# EAGLE design Main (EAGLE 7.1.0)
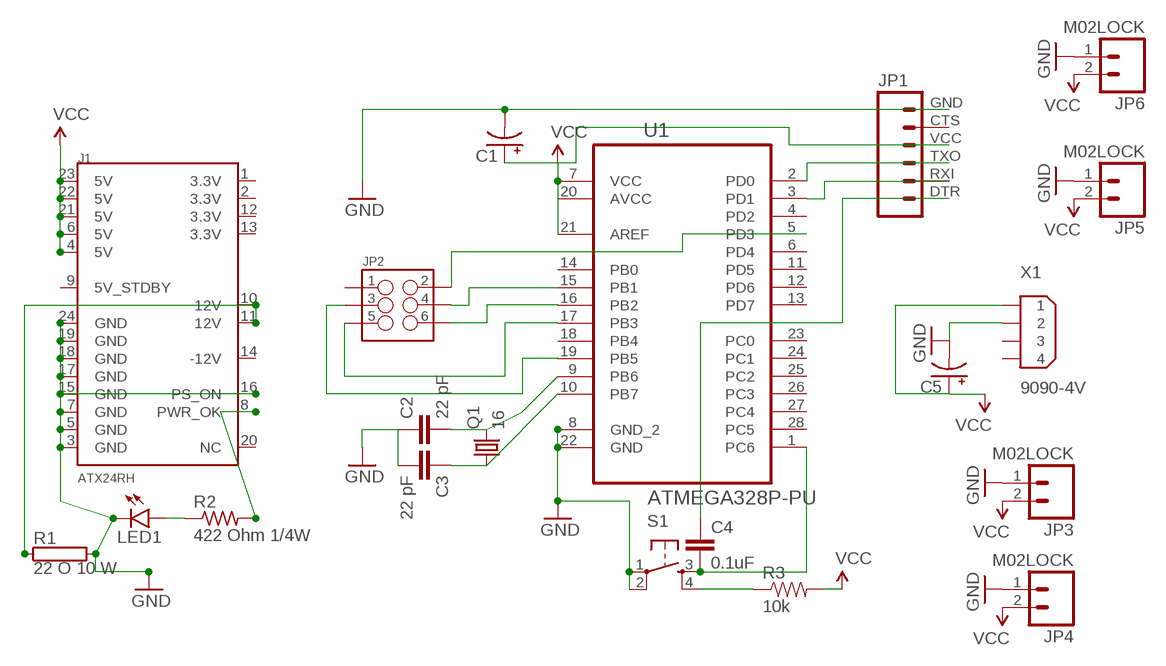
[diagram p0: schematic, sheet 1]

## Parts
C1  CAP_POLPTH2  [CPOL-RADIAL-10UF-25V]
C2  22 pF  C2,5-3  [C2.5-3]
C3  22 pF  C2,5-3  [C2.5-3]
C4  0.1uF  0.1UF-25V-5%(0603)  [0603-CAP]
C5  CAP_POLPTH2  [CPOL-RADIAL-10UF-25V]
J1  ATX24RH  [ATX24_RIGHT_ANGLE]
JP1  M06SIP  [1X06]
JP2  M03X22X3_SILK_SM  [2X3]
JP3  M02LOCK  [1X02_LOCK]
JP4  M02LOCK  [1X02_LOCK]
JP5  M02LOCK  [1X02_LOCK]
JP6  M02LOCK  [1X02_LOCK]
LED1  LED0603  [LED-0603]
Q1  16  CRYSTALHC49S  [HC49/S]
R1  22 O 10 W  RRWM8X45  [RWM8X45]
R2  422 Ohm 1/4W  R-US_M3216  [M3216]
R3  10k  10KOHM-1/4W5%(PTH)  [AXIAL-0.3]
S1  TAC_SWITCHPTH  [TACTILE-PTH]
U1  ATMEGA328P-PU  [DIP254P762X457-28]
X1  9090-4V  [9090-4V]

## Nets
GND: C1.2(-) C2.1 C3.2 C5.2(-) J1.3(GND) J1.5(GND) J1.7(GND) J1.15(GND) J1.16(PS_ON) J1.17(GND) J1.18(GND) J1.19(GND) J1.24(GND) JP1.GND JP3.1 JP4.1 JP5.1 JP6.1 LED1.C R1.2 S1.1 S1.2 U1.8(GND_2) U1.22(GND) X1.2
N$1: C4.2 S1.3 U1.1(PC6)
N$2: J1.10(12V) J1.11(12V) R1.1
N$3: LED1.A R2.1
N$4: J1.8(PWR_OK) R2.2
N$5: R3.P$1 S1.4
N$7: C2.2 Q1.2 U1.9(PB6)
N$8: C3.1 Q1.1 U1.10(PB7)
N$10: JP1.TXO U1.2(PD0)
N$11: JP1.RXI U1.3(PD1)
N$12: C4.1 JP1.DTR
N$13: JP2.3 U1.19(PB5)
N$14: JP2.5 U1.17(PB3)
N$16: JP2.6 U1.16(PB2)
N$17: JP2.4 U1.15(PB1)
N$18: JP2.2 U1.5(PD3)
VCC: C1.1(+) C5.1(+) J1.4(5V) J1.6(5V) J1.21(5V) J1.22(5V) J1.23(5V) JP1.VCC JP3.2 JP4.2 JP5.2 JP6.2 R3.P$2 U1.7(VCC) U1.20(AVCC) U1.21(AREF) X1.1
Unconnected: J1.1(3.3V) J1.2(3.3V) J1.9(5V_STDBY) J1.12(3.3V) J1.13(3.3V) J1.14(-12V) J1.20(NC) JP1.CTS JP2.1 U1.4(PD2) U1.6(PD4) U1.11(PD5) U1.12(PD6) U1.13(PD7) U1.14(PB0) U1.18(PB4) U1.23(PC0) U1.24(PC1) U1.25(PC2) U1.26(PC3) U1.27(PC4) U1.28(PC5) X1.3 X1.4

## Library data of the parts
C1 C5 = SparkFun-Capacitors:CAP_POL: Capacitor Polarized These are standard SMD and PTH capacitors. Normally 10uF, 47uF, and 100uF in electrolytic and tantalum varieties. Always verify the external diameter of the through hole cap, it varies with capacity, voltage, and manufacturer. The EIA devices should be standard.
C2 C3 = capacitor-wima:C: CAPACITOR naming: grid - package width
C4 = SparkFun-Capacitors:0.1UF-25V-5%(0603): CAP-08604; PROD_ID: CAP-08604
J1 = SparkFun-Connectors:ATX24: ATX24 Pin Power Supply Connector This is a good connector for connecting a computer power supply to a PCB. It's massive, but provides many amps of power at 5V and 12V. SKU: PRT-09498
JP1 = SparkFun-Connectors:M06: Header 6 Standard 6-pin 0.1" header. Use with straight break away headers (SKU : PRT-00116), right angle break away headers (PRT-00553), swiss pins (PRT-00743), machine pins (PRT-00117), and female headers (PRT-00115). Molex polarized connector foot print use with SKU : PRT-08094 with associated crimp pins and housings. NOTES ON THE VARIANTS LOCK and LOCK_LONGPADS... This footprint was designed to help hold the alignment of a through-hole component (i.e. 6-pin header) while soldering it into place. You may notice that each hole has been shifted either up or down by 0.005 of an inch from it's more standard position (which is a perfectly straight line). This slight alteration caused the pins (the squares in the middle) to touch the edges of the holes. Because they are alternating, it causes a "brace" to hold the component in place. 0.005 has proven to be the perfect amount of "off-center" position when using our standard breakaway headers. Although looks a little odd when you look at the bare footprint, once you have a header in there, the alteration is very hard to notice. Also,if you push a header all the way into place, it is covered up entirely on the bottom side. This idea of altering the position of holes to aid alignment will be further integrated into the Sparkfun Library for other footprints. It can help hold any component with 3 or more connection pins.
JP2 = SparkFun-Connectors:M03X2: 2x3 .1" header. Shrouded, with keying- CONN-10681 SMT- CONN-11415 Pogo pins- HW-11044
JP3-JP6 = SparkFun-Connectors:M02: Standard 2-pin 0.1" header. Use with - straight break away headers ( PRT-00116) - right angle break away headers (PRT-00553) - swiss pins (PRT-00743) - machine pins (PRT-00117) - female headers (PRT-00115) Molex polarized connector foot print use with: PRT-08233 with associated crimp pins and housings. 2.54_SCREWTERM for use with PRT-10571. 3.5mm Screw Terminal footprints for PRT-08084 5mm Screw Terminal footprints for use with PRT-08432
LED1 = SparkFun-LED:LED: LEDs Standard schematic elements and footprints for 5mm, 3mm, 1206, and 0603 sized LEDs. 5mm - Spark Fun Electronics SKU : COM-00529 (and others)
Q1 = crystal:CRYSTAL: CRYSTAL; OC_FARNELL: 1667008; OC_NEWARK: unknown
R1 = resistor-power:R: Power Resitor; OC_FARNELL: unknown; OC_NEWARK: unknown
R2 = resistor:R-US_: RESISTOR, American symbol
R3 = SparkFun-Resistors:10KOHM-1/4W5%(PTH): RES-09435; PROD_ID: RES-9435
S1 = SparkFun-Electromechanical:TAC_SWITCH: Momentary Switch Button commonly used for reset or general input. Spark Fun Electronics SKU : COM-00097 SMT- SWCH-08247
U1 = Atmel_By_element14_Batch_1-00:ATMEGA328P-PU: 8-bit Microcontroller with In-System Programmable Flash; MPN: ATMEGA328P-PU; OC_FARNELL: 1715487; OC_NEWARK: 15R0268; PACKAGE: PDIP-28; SUPPLIER: Atmel
X1 = con-thomas-betts:9090-4: Disk Drive Power four position Source: Thomas & Betts Electronic Interconnects Eiropean Edition 1998; OC_FARNELL: unknown; OC_NEWARK: unknown

## Net classes
0 default: clearance 0.205 mm

## Board
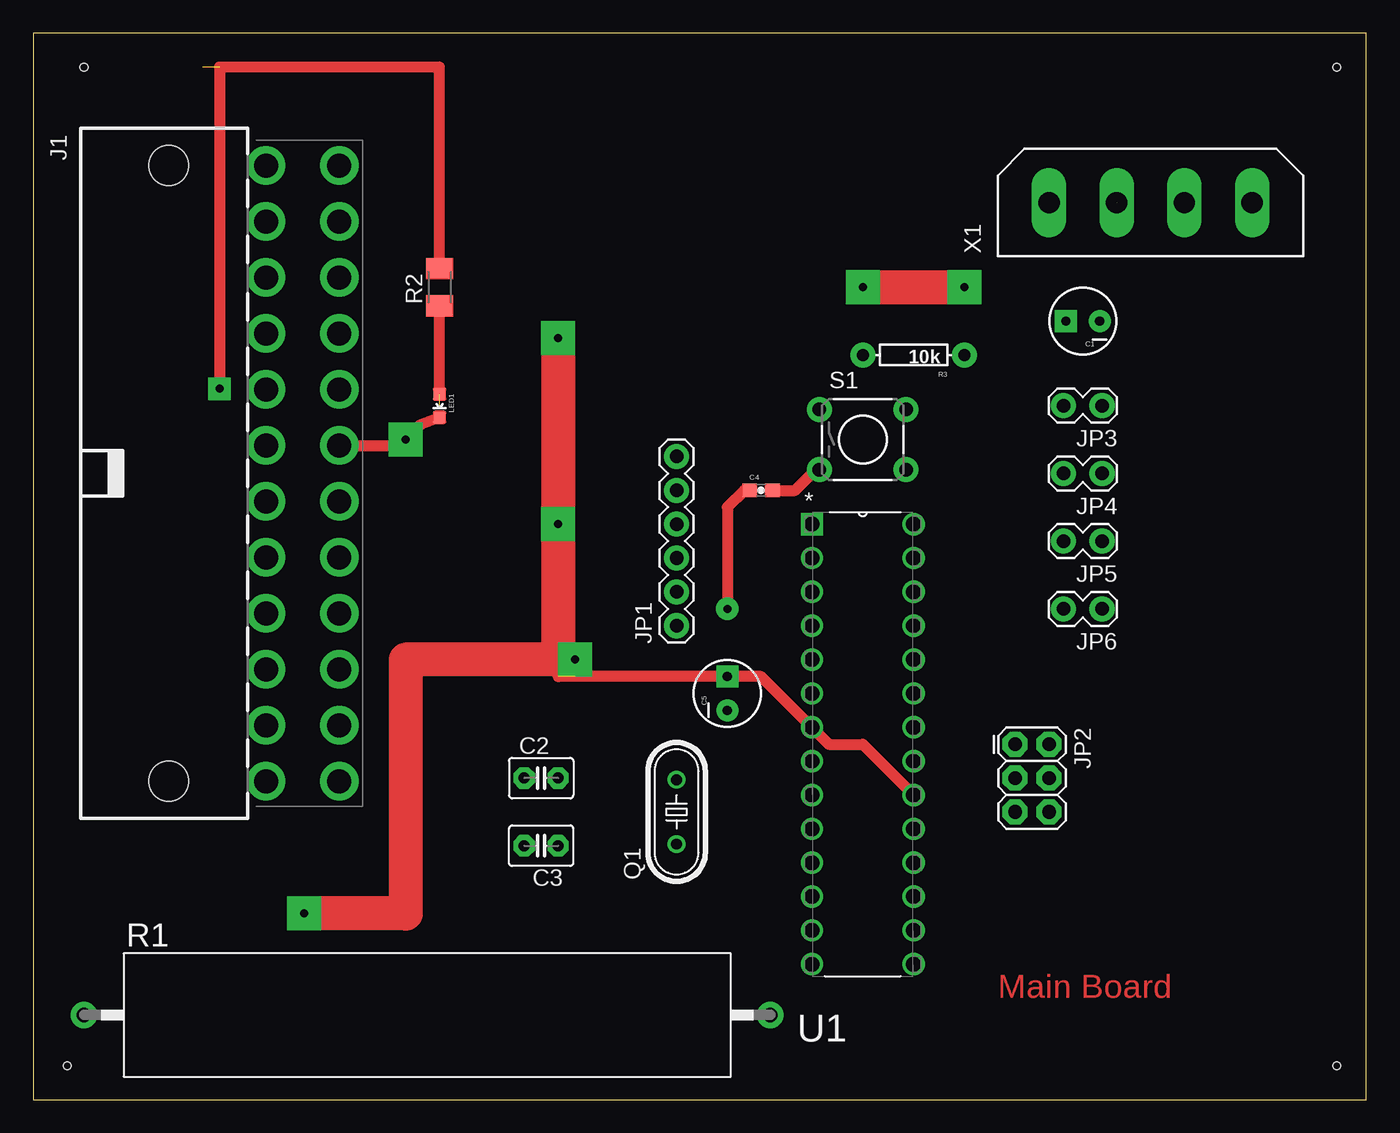
[diagram p1: board, top side]
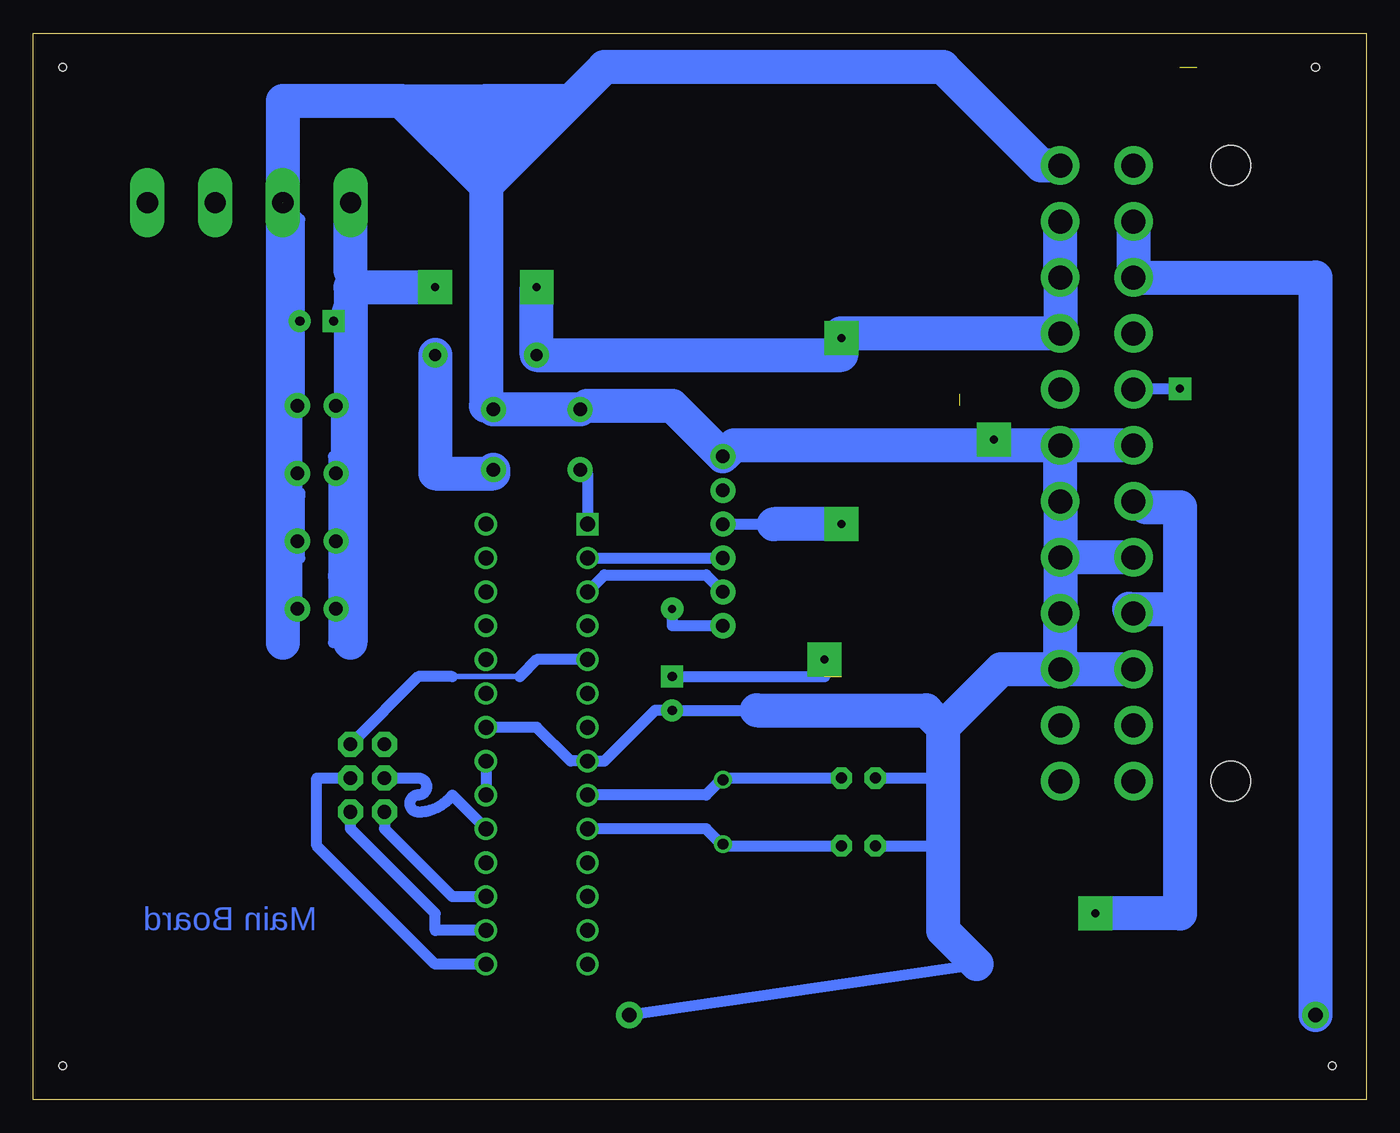
[diagram p2: board, bottom side, seen from below]

Size 100 x 80 mm. Coordinates in mm from the lower left corner, seen from the top.
Outline: 0,0 100,0 100,80 0,80 0,0
Copper layers (1*16): Top 0.035mm / dielectric 1.5mm / Bottom 0.035mm
Design rules "default": minimum track width 10mil, minimum drill 24mil, track to track 8mil, track to pad 8mil, pad to pad 8mil, via to via 8mil, smd to smd 8mil, copper to edge 40mil, drill to drill 8mil, minimum pad ring 10mil, minimum via ring 8mil, stop-mask expansion 4mil, vias tented up to drill 0mil, thermal gap 10mil
Holes 0.6 mm at 3.81,77.47 97.79,77.47 97.79,2.54 2.54,2.54

### Footprints (pad centres in the part's own frame; a part is rotated, then mirrored left to right if it is on the bottom)
CPOL-RADIAL-10UF-25V = drill 0.7 pad 1.651 square: 1 1.27,0 | drill 0.7 pad 1.651: 2 -1.27,0
C2.5-3 = drill 0.813 pad 1.6 octagon: 1 -1.27,0; 2 1.27,0
0603-CAP = smd 1.1 x 1: 1 -0.85,0; 2 0.85,0
ATX24_RIGHT_ANGLE = drill 1.8 pad 2.9: 1 23.1,4.76; 2 18.9,4.76; 3 14.7,4.76; 4 10.5,4.76; 5 6.3,4.76; 6 2.1,4.76; 7 -2.1,4.76; 8 -6.3,4.76; 9 -10.5,4.76; 10 -14.7,4.76; 11 -18.9,4.76; 12 -23.1,4.76; 13 23.1,10.26; 14 18.9,10.26; 15 14.7,10.26; 16 10.5,10.26; 17 6.3,10.26; 18 2.1,10.26; 19 -2.1,10.26; 20 -6.3,10.26; 21 -10.5,10.26; 22 -14.7,10.26; 23 -18.9,10.26; 24 -23.1,10.26 | hole 3: -23.1,-2.54; 23.1,-2.54
1X06 = drill 1.016 pad 1.88: CTS 10.16,0; DTR 0,0; GND 12.7,0; RXI 2.54,0; TXO 5.08,0; VCC 7.62,0
2X3 = drill 1.016 pad 1.88 octagon: 1 0,0; 2 0,2.54; 3 2.54,0; 4 2.54,2.54; 5 5.08,0; 6 5.08,2.54
1X02_LOCK = drill 1.016 pad 1.88: 1 -0.178,0; 2 2.718,0
LED-0603 = smd 1 x 1: A 0,-0.877; C 0,0.877
HC49/S = drill 0.813: 1 -2.413,0; 2 2.413,0
RWM8X45 = drill 1.1 pad 2: 1 -25.74,0; 2 25.74,0
M3216 = smd 1.6 x 2: 1 -1.4,0; 2 1.4,0
AXIAL-0.3 = drill 0.9 pad 1.88: P$1 -3.81,0; P$2 3.81,0
TACTILE-PTH = drill 1.016 pad 1.88: 1 -3.251,2.261; 2 3.251,2.261; 3 -3.251,-2.261; 4 3.251,-2.261
DIP254P762X457-28 = drill 1.118 square: 1 -7.62,33.02 | drill 1.118: 2 -7.62,30.48; 3 -7.62,27.94; 4 -7.62,25.4; 5 -7.62,22.86; 6 -7.62,20.32; 7 -7.62,17.78; 8 -7.62,15.24; 9 -7.62,12.7; 10 -7.62,10.16; 11 -7.62,7.62; 12 -7.62,5.08; 13 -7.62,2.54; 14 -7.62,0; 15 0,0; 16 0,2.54; 17 0,5.08; 18 0,7.62; 19 0,10.16; 20 0,12.7; 21 0,15.24; 22 0,17.78; 23 0,20.32; 24 0,22.86; 25 0,25.4; 26 0,27.94; 27 0,30.48; 28 0,33.02
9090-4V = drill 1.6 pad 2.6 long: 1 -7.62,0; 2 -2.54,0; 3 2.54,0; 4 7.62,0

### Placement (x,y rotation side)
C1  78.74,58.42 180 top
C2  38.1,24.13 0 top
C3  38.1,19.05 180 top
C4  54.61,45.72 0 top
C5  52.07,30.48 90 top
J1  12.7,46.99 270 top
JP1  48.26,35.56 90 top
JP2  73.66,26.67 270 top
JP3  80.01,52.07 180 top
JP4  80.01,46.99 180 top
JP5  80.01,41.91 180 top
JP6  80.01,36.83 180 top
LED1  30.48,52.07 180 top
Q1  48.26,21.59 90 top
R1  29.55,6.35 0 top
R2  30.48,60.96 90 top
R3  66.04,55.88 180 top
S1  62.23,49.53 0 top
U1  66.04,10.16 0 top
X1  83.82,67.31 0 top

### Tracks (layer width: path | path; a pad name or v marks a point on that pad's centre or on a via)
GND  (via drill 0.6 pad 2.54)  (1 unrouted)
  Top 0.813: LED1.C 29.06,50.65 v27.94,49.53 27.5,49.09 J1.19
  Bottom 0.813: 58.42,52.07 S1.1 | 66.04,52.07 S1.2 | R1.2 29.21,10.16 | C3.2 31.75,19.05 | U1.22 62.23,27.94 59.69,25.4 U1.8 57.15,25.4 53.34,29.21 C5.2 45.72,29.21 | JP6.1 80.19,40.46 80.01,40.64 80.01,45.54 JP5.1 JP4.1 JP3.1 80.19,52.25 80.01,52.07 C1.2 | C1.2 80.01,66.04 X1.2 | C1.2 81.28,62.23 | C2.1 31.75,24.13
  Bottom 2.54: J1.24 24.37,70.09 31.75,77.47 57.15,77.47 59.69,74.93 | 59.69,74.93 66.04,68.58 | 66.04,68.58 66.04,52.07 | S1.1 S1.2 | 66.04,68.58 72.39,74.93 | 72.39,74.93 81.28,74.93 X1.2 81.28,62.23 81.28,34.29 | 72.39,74.93 66.04,74.93 | 59.69,74.93 66.04,74.93 | 66.04,74.93 66.04,73.66 | 66.04,69.85 66.04,73.66 | 66.04,73.66 63.5,73.66 63.5,72.39 68.58,72.39 68.58,73.66 | 58.42,52.07 52.07,52.07 JP1.GND 47.43,49.09 J1.19 | J1.7 J1.19 | J1.19 J1.18 J1.17 | J1.5 J1.17 | J1.17 J1.16 J1.15 | J1.3 22.13,32.29 22.86,33.02 22.86,32.39 J1.15 | J1.15 27.4,32.29 31.75,27.94 | 31.75,27.94 31.75,24.13 31.75,19.05 31.75,12.7 29.21,10.16 | 45.72,29.21 33.02,29.21 31.75,27.94
N$1
  Top 0.813: C4.2 57.15,45.72 58.42,46.99 S1.3
  Bottom 0.813: U1.1 58.42,46.99 S1.3
N$2
  Bottom 2.54: J1.11 J1.10 3.81,61.69 R1.1
N$3  (1 unrouted)
  Top 0.813: 30.48,59.69 R2.1 LED1.A
N$4  (via drill 0.6 pad 1.68)  (1 unrouted)
  Top 0.813: 30.48,62.23 R2.2 30.48,77.47 13.97,77.47 v13.97,53.34
  Bottom 0.813: v13.97,53.34 16.51,53.34 J1.8
N$5
  Bottom 2.54: R3.P$1 69.85,46.99 65.48,46.99 S1.4
N$6  (via drill 0.6 pad 2.54)
  other vias: 40.64,33.02
N$7
  Bottom 0.813: U1.9 49.53,22.86 48.26,24.13 | 48.26,24.13 C2.2 | 48.26,24.13 Q1.2
N$8
  Bottom 0.813: U1.10 49.53,20.32 48.26,19.05 | 48.26,19.05 C3.1 | 48.26,19.05 Q1.1
N$10
  Bottom 0.813: U1.2 JP1.TXO
N$11
  Bottom 0.813: JP1.RXI 49.53,39.37 57.15,39.37 U1.3
N$12  (via drill 0.6 pad 1.68)
  Top 0.813: v52.07,36.83 52.07,44.45 53.34,45.72 C4.1
  Bottom 0.813: JP1.DTR 52.07,35.56 v52.07,36.83
N$13
  Bottom 0.813: JP2.3 71.12,24.13 arc180 71.12,22.86 arc-180 71.12,21.59 arc-53 68.58,22.86 U1.19
N$14
  Bottom 0.813: JP2.5 73.66,20.32 68.58,15.24 U1.17
N$16
  Bottom 0.813: U1.16 69.85,12.7 69.85,13.97 76.2,20.32 JP2.6
N$17
  Bottom 0.813: U1.15 69.85,10.16 78.74,19.05 78.74,24.13 JP2.4
N$18
  Bottom 0.406: 63.5,31.75 68.58,31.75
  Bottom 0.813: U1.5 62.23,33.02 63.5,31.75 | 68.58,31.75 71.12,31.75 JP2.2
VCC  (via drill 0.6 pad 2.54)  (1 unrouted)
  Top 0.813: U1.20 62.23,26.67 59.69,26.67 U1.7 54.61,31.75 39.37,31.75 39.37,33.02
  Top 2.54: v39.37,57.15 v39.37,43.18 39.37,33.02 27.94,33.02 27.94,13.97 v20.32,13.97 | v62.23,60.96 v69.85,60.96
  Bottom 0.813: 13.97,36.83 16.51,36.83 J1.4 | 16.51,44.45 J1.6 | JP1.VCC 44.45,43.18 | U1.21 U1.20 | JP3.2 JP4.2 77.29,48.44 77.47,48.26 77.47,46.99 | 77.47,46.99 77.47,39.37 | 77.47,39.37 77.47,34.29 76.2,34.29 | JP6.2 77.47,39.37 | JP5.2 77.29,46.81 77.47,46.99 | C5.1 40.64,31.75 40.64,33.02 | C1.1 76.2,62.23 76.2,60.96
  Bottom 2.54: 16.51,44.45 13.97,44.45 13.97,36.83 | J1.23 J1.22 J1.21 39.37,57.49 v39.37,57.15 39.37,55.88 R3.P$2 v62.23,60.96 | v39.37,43.18 44.45,43.18 | 17.78,36.83 13.97,36.83 | 13.97,36.83 13.97,13.97 v20.32,13.97 | v69.85,60.96 76.2,60.96 76.2,34.29 | 76.2,62.23 X1.1

### Text on the board
Top: Main Board
Bottom: Main Board